# Altium project Alarm.PrjPcb
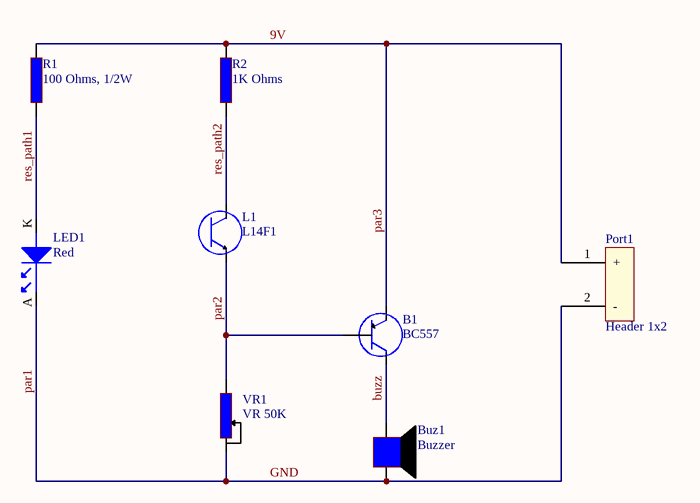
[diagram p0: alarm.SchDoc]
1 sheet, 8 parts. Net scope: global (net labels, ports and power ports of the same name join across sheets).
Board file: alarm.PcbDoc

## Sheet alarm.SchDoc
size A4

### Parts
B1  BC557  [BJT]
Buz1  Buzzer  [Buz]
L1  L14F1  [phototransistor]
LED1  Red  [LED_red]
Port1  Header 1x2  [Port 1x2]
R1  100 Ohms, 1/2W  [R100 - duplicate]
R2  1K Ohms  [R1K]
VR1  VR 50K  [R1K]

### Nets
9V: B1.3 Port1.1(+) R1.1 R2.1  [also labelled par3]
buzz: B1.5 Buz1.1
GND: Buz1.2 LED1.A Port1.2(-) VR1.2  [also labelled par1]
par2: B1.4 L1.2 VR1.1
res_path1: LED1.K R1.2
res_path2: L1.1 R2.2

### Library data of the parts
B1 = BC557BRL1G: Trans GP BJT PNP 45V 0.1A 3-Pin TO-92 T/R; Manufacturer: ON Semiconductor; Frequency: 320MHz; Max Power Dissipation: 625mW; hFE Min: 180; Max Collector Current: 100mA; Emitter Base Voltage (VEBO): 5V; Number of Elements: 1; Collector Base Voltage (VCBO): 50V; Collector Emitter Saturation Voltage: -300mV; Element Configuration: Single; Voltage Rating (DC): -45V; Current Rating: -100mA; Collector-emitter Voltage-Max: 650mV; Supplier 1: Avnet; Supplier Part Number 1: BC557BRL1G; Manufacturer Part Number: BC557BRL1G; Stock 1: 122273; Pricing 1: 3206 = 0.11076, 3300 = 0.10920, 6500 = 0.10608, 17000 = 0.10374, 33000 = 0.09984, 170000 = 0.09750, 330000 = 0.09516 (USD); RoHS: Yes; Case/Package: TO-92-3; Number of Pins: 3; Contact Plating: Copper,Tin,Silver; Min Operating Temperature: -55°C; Max Operating Temperature: 150°C; Package Quantity: 1; Collector Emitter Voltage (VCEO): 45V; Packaging: Tape and Reel; Transition Frequency: 320MHz; Collector Emitter Breakdown Voltage: 45V; Max Breakdown Voltage: 45V; Polarity: PNP; Power Dissipation: 625mW; Gain Bandwidth Product: 320MHz; Max Frequency: 320MHz; Series: -; Length: 5.2mm; Width: 4.19mm; Height: 5.33mm; Radiation Hardening: No; REACH SVHC: No SVHC; Lead Free: Lead Free; RoHS Compliant: Yes; ComponentLink1URL: https://datasheet.ciiva.com/976/bc556b-d-976565.pdf?src-supplier=Digi-Key; ComponentLink1Description: https://datasheet.ciiva.com/976/bc556b-d-976565.pdf?src-supplier=Digi-Key; ComponentLink2URL: https://datasheet.ciiva.com/976/bc556b-d-976566.pdf?src-supplier=Digi-Key; ComponentLink2Description: https://datasheet.ciiva.com/976/bc556b-d-976566.pdf?src-supplier=Digi-Key; ComponentLink3URL: https://datasheet.ciiva.com/26816/getdatasheetpartid-53822-26816822.pdf?src-supplier=Verical; ComponentLink3Description: https://datasheet.ciiva.com/26816/getdatasheetpartid-53822-26816822.pdf?src-supplier=Verical; ComponentLink4URL: https://datasheet.ciiva.com/16379/bc556b-d-16379225.pdf?src-supplier=Future+Electronics; ComponentLink4Description: https://datasheet.ciiva.com/16379/bc556b-d-16379225.pdf?src-supplier=Future+Electronics; ComponentLink5URL: https://datasheet.ciiva.com/25996/bc556b-d-25996316.pdf?src-supplier=Avnet+Europe; ComponentLink5Description: https://datasheet.ciiva.com/25996/bc556b-d-25996316.pdf?src-supplier=Avnet+Europe; ComponentLink6URL: https://datasheet.ciiva.com/11204/bc556b-d-11204303.pdf?src-supplier=Avnet; ComponentLink6Description: https://datasheet.ciiva.com/11204/bc556b-d-11204303.pdf?src-supplier=Avnet; Category: Discrete Semiconductor Products
Buz1 = AT-1224-TWT-5V-2-R: AUDIO MAGNETIC XDCR 3-7V TH; Manufacturer: Projects Unlimited; Voltage Rating: 5V; Frequency: 2.4kHz; Operating Supply Current: 40mA; Supplier 1: Digi-Key; Supplier Part Number 1: 668-1470-ND; Manufacturer Part Number: AT-1224-TWT-5V-2-R; Stock 1: 74191; Pricing 1: 1 = 0.61000, 10 = 0.52000, 25 = 0.48640, 40 = 0.46125, 100 = 0.43680, 500 = 0.38252, 1000 = 0.36032, 4900 = 0.31168 (USD); RoHS: Yes; Mount: Through Hole; Contact Plating: Tin; Min Operating Temperature: -30°C; Max Operating Temperature: 70°C; Packaging: Tray; Termination: PC Pins; Sensing Method: Magnetic; Max Supply Current: 40mA; Diameter: 12mm; Height: 9mm; ComponentLink1URL: http://www.mouser.com/ds/2/334/AT-1224-TWT-5V-2-R-532234.pdf?src-supplier=Mouser; ComponentLink1Description: http://www.mouser.com/ds/2/334/AT-1224-TWT-5V-2-R-532234.pdf?src-supplier=Mouser; ComponentLink2URL: http://www.puiaudio.com/pdf/AT-1224-TWT-5V-2-R.pdf?src-supplier=Digi-Key; ComponentLink2Description: http://www.puiaudio.com/pdf/AT-1224-TWT-5V-2-R.pdf?src-supplier=Digi-Key; ComponentLink3URL: http://www.puiaudio.com/pdf/AT-1224-TWT-5V-2-R.pdf?src-supplier=Avnet; ComponentLink3Description: http://www.puiaudio.com/pdf/AT-1224-TWT-5V-2-R.pdf?src-supplier=Avnet; Category: Audio Products
L1 = L14F1: Photodarlington Chip Silicon 940nm 3-Pin TO-18 Bulk; Manufacturer: ON Semiconductor / Fairchild; Rise Time: 300us; Max Power Dissipation: 300mW; Fall Time: 250us; Viewing Angle: 16°; Collector Emitter Voltage (VCEO): 25V; Polarity: NPN; Number of Elements: 1; Power Dissipation: 600mW; Dark Current: 100nA; Max Collector Current: 7.5mA; Supplier 1: Farnell; Supplier Part Number 1: 1021141; Manufacturer Part Number: L14F1; Stock 1: 0; Pricing 1: 1 = 2.73000, 25 = 1.92000, 100 = 1.33000, 1000 = 1.20000 (GBP); RoHS: Yes; Mount: Through Hole; Case/Package: TO-18; Number of Pins: 3; Min Operating Temperature: -65°C; Max Operating Temperature: 125°C; Wavelength: 940nm; Packaging: Bulk; Package Quantity: 500; Orientation: Top View; Collector Emitter Breakdown Voltage: 25V; Breakdown Voltage: 25V; Series: *; Power Consumption: 300mW; Voltage Rating (DC): 25V; Current Rating: 7.5mA; RoHS Compliant: Yes; Lead Free: Lead Free; ComponentLink1URL: https://datasheet.ciiva.com/4270/l14f1-4270771.pdf?src-supplier=Arrow+Electronics; ComponentLink1Description: https://datasheet.ciiva.com/4270/l14f1-4270771.pdf?src-supplier=Arrow+Electronics; ComponentLink2URL: https://datasheet.ciiva.com/2821/l14f1-20l14f2-2821058.pdf?src-supplier=Digi-Key; ComponentLink2Description: https://datasheet.ciiva.com/2821/l14f1-20l14f2-2821058.pdf?src-supplier=Digi-Key; ComponentLink3URL: https://datasheet.ciiva.com/1249/94970-1249385.pdf?src-supplier=Element14; ComponentLink3Description: https://datasheet.ciiva.com/1249/94970-1249385.pdf?src-supplier=Element14; Category: Phototransistor
LED1 = LTST-C191KRKT: On a Reel of 5000, 2.4 V Red LED 1608 (0603) SMD, Lite-On LTST-C191KRKT; Manufacturer: Vishay Lite-On; Lens Color: Colorless; Power Rating: 75mW; Luminous Intensity: 54mcd; Viewing Angle: 130°; Forward Voltage: 2V; Lens Style: Clear,Diffused,Colorless,Rectangular; Forward Current: 30mA; Dominant Wavelength: 631nm; Test Current: 20mA; Lens Transparency: Clear; Number of Elements: 1; Wavelength: 639nm; Reverse Voltage: 5V; Supplier 1: Digi-Key; Supplier Part Number 1: 160-1447-1-ND; Manufacturer Part Number: LTST-C191KRKT; Stock 1: 538127; Pricing 1: 1 = 0.26000, 10 = 0.14100, 100 = 0.06560, 500 = 0.06060, 1000 = 0.04747, 2000 = 0.04646 (USD); RoHS: Yes; Mount: Surface Mount; Case/Package: 0603; Number of Pins: 2; Color: Red; Case Code (Metric): 1608; Case Code (Imperial): 0603; Min Operating Temperature: -55°C; Max Operating Temperature: 85°C; Packaging: Tape and Reel; Package Quantity: 1; Illumination Color: Red; Power Dissipation: 75mW; Number of LEDs: 1; Voltage: 2V; Length: 1.6mm; Width: 0.8mm; Height: 0.55mm; Depth: 0.8mm; Radiation Hardening: No; Lead Free: Lead Free; RoHS Compliant: Yes; ComponentLink1URL: https://datasheet.ciiva.com/11773/0900766b80dc02b2-11773601.pdf?src-supplier=RSComponents; ComponentLink1Description: https://datasheet.ciiva.com/11773/0900766b80dc02b2-11773601.pdf?src-supplier=RSComponents; ComponentLink2URL: https://datasheet.ciiva.com/16212/ltst-c191krkt-16212419.pdf?src-supplier=Future+Electronics; ComponentLink2Description: https://datasheet.ciiva.com/16212/ltst-c191krkt-16212419.pdf?src-supplier=Future+Electronics; ComponentLink3URL: https://datasheet.ciiva.com/15117/getdatasheetpartid-141922-15117737.pdf?src-supplier=Verical; ComponentLink3Description: https://datasheet.ciiva.com/15117/getdatasheetpartid-141922-15117737.pdf?src-supplier=Verical; ComponentLink4URL: https://datasheet.ciiva.com/12400/lite-on-ltst-c191krkt-190135-12400910.pdf?src-supplier=Mouser; ComponentLink4Description: https://datasheet.ciiva.com/12400/lite-on-ltst-c191krkt-190135-12400910.pdf?src-supplier=Mouser; ComponentLink5URL: https://datasheet.ciiva.com/2109/s-110-ltst-c191krkt-2109970.pdf?src-supplier=Digi-Key; ComponentLink5Description: https://datasheet.ciiva.com/2109/s-110-ltst-c191krkt-2109970.pdf?src-supplier=Digi-Key; ComponentLink6URL: https://datasheet.ciiva.com/2109/s-110-ltst-c191krkt-2109971.pdf?src-supplier=Digi-Key; ComponentLink6Description: https://datasheet.ciiva.com/2109/s-110-ltst-c191krkt-2109971.pdf?src-supplier=Digi-Key; ComponentLink7URL: https://datasheet.ciiva.com/2109/s-110-ltst-c191krkt-2109972.pdf?src-supplier=Digi-Key; ComponentLink7Description: https://datasheet.ciiva.com/2109/s-110-ltst-c191krkt-2109972.pdf?src-supplier=Digi-Key; Category: Optoelectronics
Port1 = 3-641215-2: CONN HEADER VERT 2POS 2.54MM; Manufacturer: TE Connectivity; Underplate Material: Nickel; Contact Resistance: 6mR; Current Rating: 5A; Voltage Rating: 250V; Number of Positions: 2; Connector Type: Plug,Header,Pin; Gender: Male; Backwall/Post Interruptions: No (Without); Connector System: Wire-to-Board; Mating Retention: Yes (With); PCB Mount Retention: Without; PCB Mounting Orientation: Vertical; Contact Style: Straight; Contact Post Length: 3.56mm; Plating Thickness: 0.76um; PCB Thickness: 0.063inch; Approvals: CSA; Supplier 1: Digi-Key; Supplier Part Number 1: A30786-ND; Manufacturer Part Number: 3-641215-2; Stock 1: 8783; Pricing 1: 1 = 0.65000, 10 = 0.60800, 100 = 0.46620, 500 = 0.40540, 1000 = 0.33445, 5000 = 0.29391, 10000 = 0.27364 (USD); RoHS: Yes; Mount: Through Hole; Contact Material: Copper Alloy; Contact Plating: Gold,Tin,Matte; Color: Natural,Beige; Housing Color: White; Housing Material: Polyester; Contact Shape: Square; Min Operating Temperature: -67°C; Max Operating Temperature: 221°C; Number of Rows: 1; Package Quantity: 1; Fastening Type: Friction; Packaging: Bulk; Contact Gender: Male; Max Voltage Rating (AC): 250V; Termination: Solder; Number of Contacts: 2; Orientation: Straight; Voltage Rating (AC): 250V; Contact Retention: No (Without); Mating Alignment: No (Without); PCB Mount Alignment: No (Without); Sealable: No (Without); Strain Relief: No (Without); Shrouded: No (Without); Contact Current Rating: 5A; Series: MTA-100; Contact Type: Male Pin; Length: 5.08mm; Height: 7.87mm; Pitch: 2.54mm; Contact Mating Length: 7.49mm; Depth: 5.71mm; Tail Length: 3.56mm; Radiation Hardening: No; REACH SVHC: No SVHC; Flammability Rating: UL94 V-0; ELV: Compliant; Lead Free: Lead Free; RoHS Compliant: Yes; ComponentLink1URL: https://datasheet.ciiva.com/15175/getdatasheetpartid-46728-15175696.pdf?src-supplier=Verical; ComponentLink1Description: https://datasheet.ciiva.com/15175/getdatasheetpartid-46728-15175696.pdf?src-supplier=Verical; ComponentLink2URL: https://datasheet.ciiva.com/19463/751066-19463331.pdf?src-supplier=Jameco; ComponentLink2Description: https://datasheet.ciiva.com/19463/751066-19463331.pdf?src-supplier=Jameco; ComponentLink3URL: https://datasheet.ciiva.com/11747/0900766b80f959d9-11747636.pdf?src-supplier=RSComponents; ComponentLink3Description: https://datasheet.ciiva.com/11747/0900766b80f959d9-11747636.pdf?src-supplier=RSComponents; ComponentLink4URL: https://datasheet.ciiva.com/16210/eng-ds-82056-mta-0608-16210282.pdf?src-supplier=Future+Electronics; ComponentLink4Description: https://datasheet.ciiva.com/16210/eng-ds-82056-mta-0608-16210282.pdf?src-supplier=Future+Electronics; ComponentLink5URL: https://datasheet.ciiva.com/16684/eng-ds-82056-mta-0608-16684998.pdf?src-supplier=Avnet+Europe; ComponentLink5Description: https://datasheet.ciiva.com/16684/eng-ds-82056-mta-0608-16684998.pdf?src-supplier=Avnet+Europe; ComponentLink6URL: https://datasheet.ciiva.com/709/eng-cd-641215-z1-709783.pdf?src-supplier=Digi-Key; ComponentLink6Description: https://datasheet.ciiva.com/709/eng-cd-641215-z1-709783.pdf?src-supplier=Digi-Key; ComponentLink7URL: https://datasheet.ciiva.com/30150/8852eng-ds-82056-mta-0608-30150698.pdf?src-supplier=Onlinecomponents.com; ComponentLink7Description: https://datasheet.ciiva.com/30150/8852eng-ds-82056-mta-0608-30150698.pdf?src-supplier=Onlinecomponents.com; ComponentLink8URL: https://datasheet.ciiva.com/3118/eng-ds-82056-mta-0608-3118187.pdf?src-supplier=Avnet; ComponentLink8Description: https://datasheet.ciiva.com/3118/eng-ds-82056-mta-0608-3118187.pdf?src-supplier=Avnet
R1 = ERJ-P06F1000V: RESISTOR, SURGE, 0805, 1%, 100R; Manufacturer: Panasonic; Power Rating: 500mW; Voltage Rating: 150V; Temperature Coefficient: 100ppm/°C; Supplier 1: Digi-Key; Supplier Part Number 1: P16057CT-ND; Manufacturer Part Number: ERJ-P06F1000V; Stock 1: 56070; Pricing 1: 1 = 0.18000, 10 = 0.15400, 100 = 0.06030, 1000 = 0.02525, 2500 = 0.02315 (USD); RoHS: Yes; Mount: Surface Mount; Case/Package: 0805; Number of Pins: 2; Case Code (Imperial): 0805; Case Code (Metric): 2012; Contact Plating: Tin; Min Operating Temperature: -55°C; Max Operating Temperature: 155°C; Resistance: 100R; Tolerance: 1%; Packaging: Tape and Reel; Package Quantity: 5000; Resistor Type: Thick Film; Termination: SMD/SMT; Voltage Rating (DC): 150V; Length: 2mm; Width: 1.2mm; Height: 0.6mm; Depth: 1.25mm; Radiation Hardening: No; REACH SVHC: No SVHC; Military Standard: Not; RoHS Compliant: Yes; ComponentLink1URL: https://datasheet.ciiva.com/11817/0900766b812cb812-11817182.pdf?src-supplier=RSComponents; ComponentLink1Description: https://datasheet.ciiva.com/11817/0900766b812cb812-11817182.pdf?src-supplier=RSComponents; ComponentLink2URL: https://datasheet.ciiva.com/17208/aoa0000ce4-17208007.pdf?src-supplier=Avnet+Europe; ComponentLink2Description: https://datasheet.ciiva.com/17208/aoa0000ce4-17208007.pdf?src-supplier=Avnet+Europe; ComponentLink3URL: https://datasheet.ciiva.com/7830/1790600-7830815.pdf?src-supplier=Element14; ComponentLink3Description: https://datasheet.ciiva.com/7830/1790600-7830815.pdf?src-supplier=Element14; ComponentLink4URL: https://datasheet.ciiva.com/30103/aoa0000ce4-30103141.pdf?src-supplier=Onlinecomponents.com; ComponentLink4Description: https://datasheet.ciiva.com/30103/aoa0000ce4-30103141.pdf?src-supplier=Onlinecomponents.com; ComponentLink5URL: https://datasheet.ciiva.com/24070/aoa0000ce4-64075-24070038.pdf?src-supplier=Mouser; ComponentLink5Description: https://datasheet.ciiva.com/24070/aoa0000ce4-64075-24070038.pdf?src-supplier=Mouser; ComponentLink6URL: https://datasheet.ciiva.com/48426/erjp-series-eng-tds-48426777.pdf?src-supplier=Distrelec; ComponentLink6Description: https://datasheet.ciiva.com/48426/erjp-series-eng-tds-48426777.pdf?src-supplier=Distrelec; ComponentLink7URL: https://datasheet.ciiva.com/9186/aoa0000ce4-9186922.pdf?src-supplier=Avnet; ComponentLink7Description: https://datasheet.ciiva.com/9186/aoa0000ce4-9186922.pdf?src-supplier=Avnet; ComponentLink8URL: https://datasheet.ciiva.com/22758/1801181-22758282.pdf?src-supplier=Farnell; ComponentLink8Description: https://datasheet.ciiva.com/22758/1801181-22758282.pdf?src-supplier=Farnell; ComponentLink9URL: https://datasheet.ciiva.com/22758/1801181-22758283.pdf?src-supplier=Farnell; ComponentLink9Description: https://datasheet.ciiva.com/22758/1801181-22758283.pdf?src-supplier=Farnell; Category: Resistors
R2 = ERA-2AED102X: PANASONIC - ERA-2AED102X - SMD Chip Resistor, 0402 [1005 Metric], 1 kohm, ERA2A Series, 50 V, Thin Film, 63 mW; Resistance: 1kR; Tolerance: 0.5%; Power Rating: 62.5mW; Voltage Rating: 25V; Temperature Coefficient: 25ppm/°C; Max Power Dissipation: 63mW; Supplier 1: Digi-Key; Supplier Part Number 1: P1.0KDECT-ND; Manufacturer: Panasonic; Manufacturer Part Number: ERA-2AED102X; Stock 1: 25349; Pricing 1: 1 = 0.19000, 10 = 0.16300, 100 = 0.06360, 1000 = 0.02664, 2500 = 0.02442, 5000 = 0.02220 (USD); RoHS: Yes; Mount: Surface Mount; Case/Package: 0402; Case Code (Metric): 1005; Case Code (Imperial): 0402; Weight: 2.8E-05oz; Contact Plating: Tin; Min Operating Temperature: -55°C; Max Operating Temperature: 155°C; Packaging: Tape and Reel; Package Quantity: 10000; Termination: SMD/SMT; Resistor Type: Metal Film,Thin Film; Number of Terminations: 2; Voltage Rating (DC): 25V; Series: ERA-2A; Construction: Rectangular; Resistance Tolerance: 0.5%; Length: 1mm; Width: 0.5mm; Height: 0.016inch; Depth: 0.5mm; Radiation Hardening: No; REACH SVHC: No SVHC; Military Standard: Not; Lead Free: Lead Free; RoHS Compliant: Yes; ComponentLink1URL: https://datasheet.ciiva.com/7942/1776116-7942453.pdf?src-supplier=Element14; ComponentLink1Description: https://datasheet.ciiva.com/7942/1776116-7942453.pdf?src-supplier=Element14; ComponentLink2URL: https://datasheet.ciiva.com/9117/aoa0000ce26-9117222.pdf?src-supplier=Avnet; ComponentLink2Description: https://datasheet.ciiva.com/9117/aoa0000ce26-9117222.pdf?src-supplier=Avnet; ComponentLink3URL: https://datasheet.ciiva.com/46378/1776116-46378236.pdf?src-supplier=Element14; ComponentLink3Description: https://datasheet.ciiva.com/46378/1776116-46378236.pdf?src-supplier=Element14; ComponentLink4URL: https://datasheet.ciiva.com/16784/70068849-16784637.pdf?src-supplier=Allied+Electronics; ComponentLink4Description: https://datasheet.ciiva.com/16784/70068849-16784637.pdf?src-supplier=Allied+Electronics; Category: Resistors
VR1 = PTA3043-2010CIA503: Slide Potentiometers 50K AUDIO; Manufacturer: Bourns; Resistance: 50kR; Power Rating: 100mW; Tolerance: 20%; Supplier 1: Arrow Electronics; Supplier Part Number 1: PTA3043-2010CIA503; Manufacturer Part Number: PTA3043-2010CIA503; Stock 1: 998; Pricing 1: 1 = 0.58430 (USD); RoHS: Yes; Mount: Through Hole; Min Operating Temperature: -10°C; Max Operating Temperature: 50°C; Package Quantity: 100; Packaging: Tray; Termination: Pin; Taper: Audio; Max Power Dissipation: 100mW; Type: Potentiometer; Series: Pro Audio PTA; Technology: CARBON FILM; Length: 1.772inch; Width: 0.354inch; Height: 0.256inch; Depth: 9mm; Military Standard: Not; RoHS Compliant: Yes; ComponentLink1URL: http://www.alliedelec.com/m/d/212bda907becee0ec46ccb06c3f28298.pdf?src-supplier=Allied+Electronics; ComponentLink1Description: http://www.alliedelec.com/m/d/212bda907becee0ec46ccb06c3f28298.pdf?src-supplier=Allied+Electronics; ComponentLink2URL: http://components.arrow.com/part/dataview/47122089S8814784N1506?src-supplier=Arrow+Electronics; ComponentLink2Description: http://components.arrow.com/part/dataview/47122089S8814784N1506?src-supplier=Arrow+Electronics; ComponentLink3URL: http://www.bourns.com/docs/Product-Datasheets/pta.pdf?src-supplier=Digi-Key; ComponentLink3Description: http://www.bourns.com/docs/Product-Datasheets/pta.pdf?src-supplier=Digi-Key; ComponentLink4URL: http://www.bourns.com/data/global/pdfs/PTA.pdf?src-supplier=Mouser; ComponentLink4Description: http://www.bourns.com/data/global/pdfs/PTA.pdf?src-supplier=Mouser; Category: Potentiometers